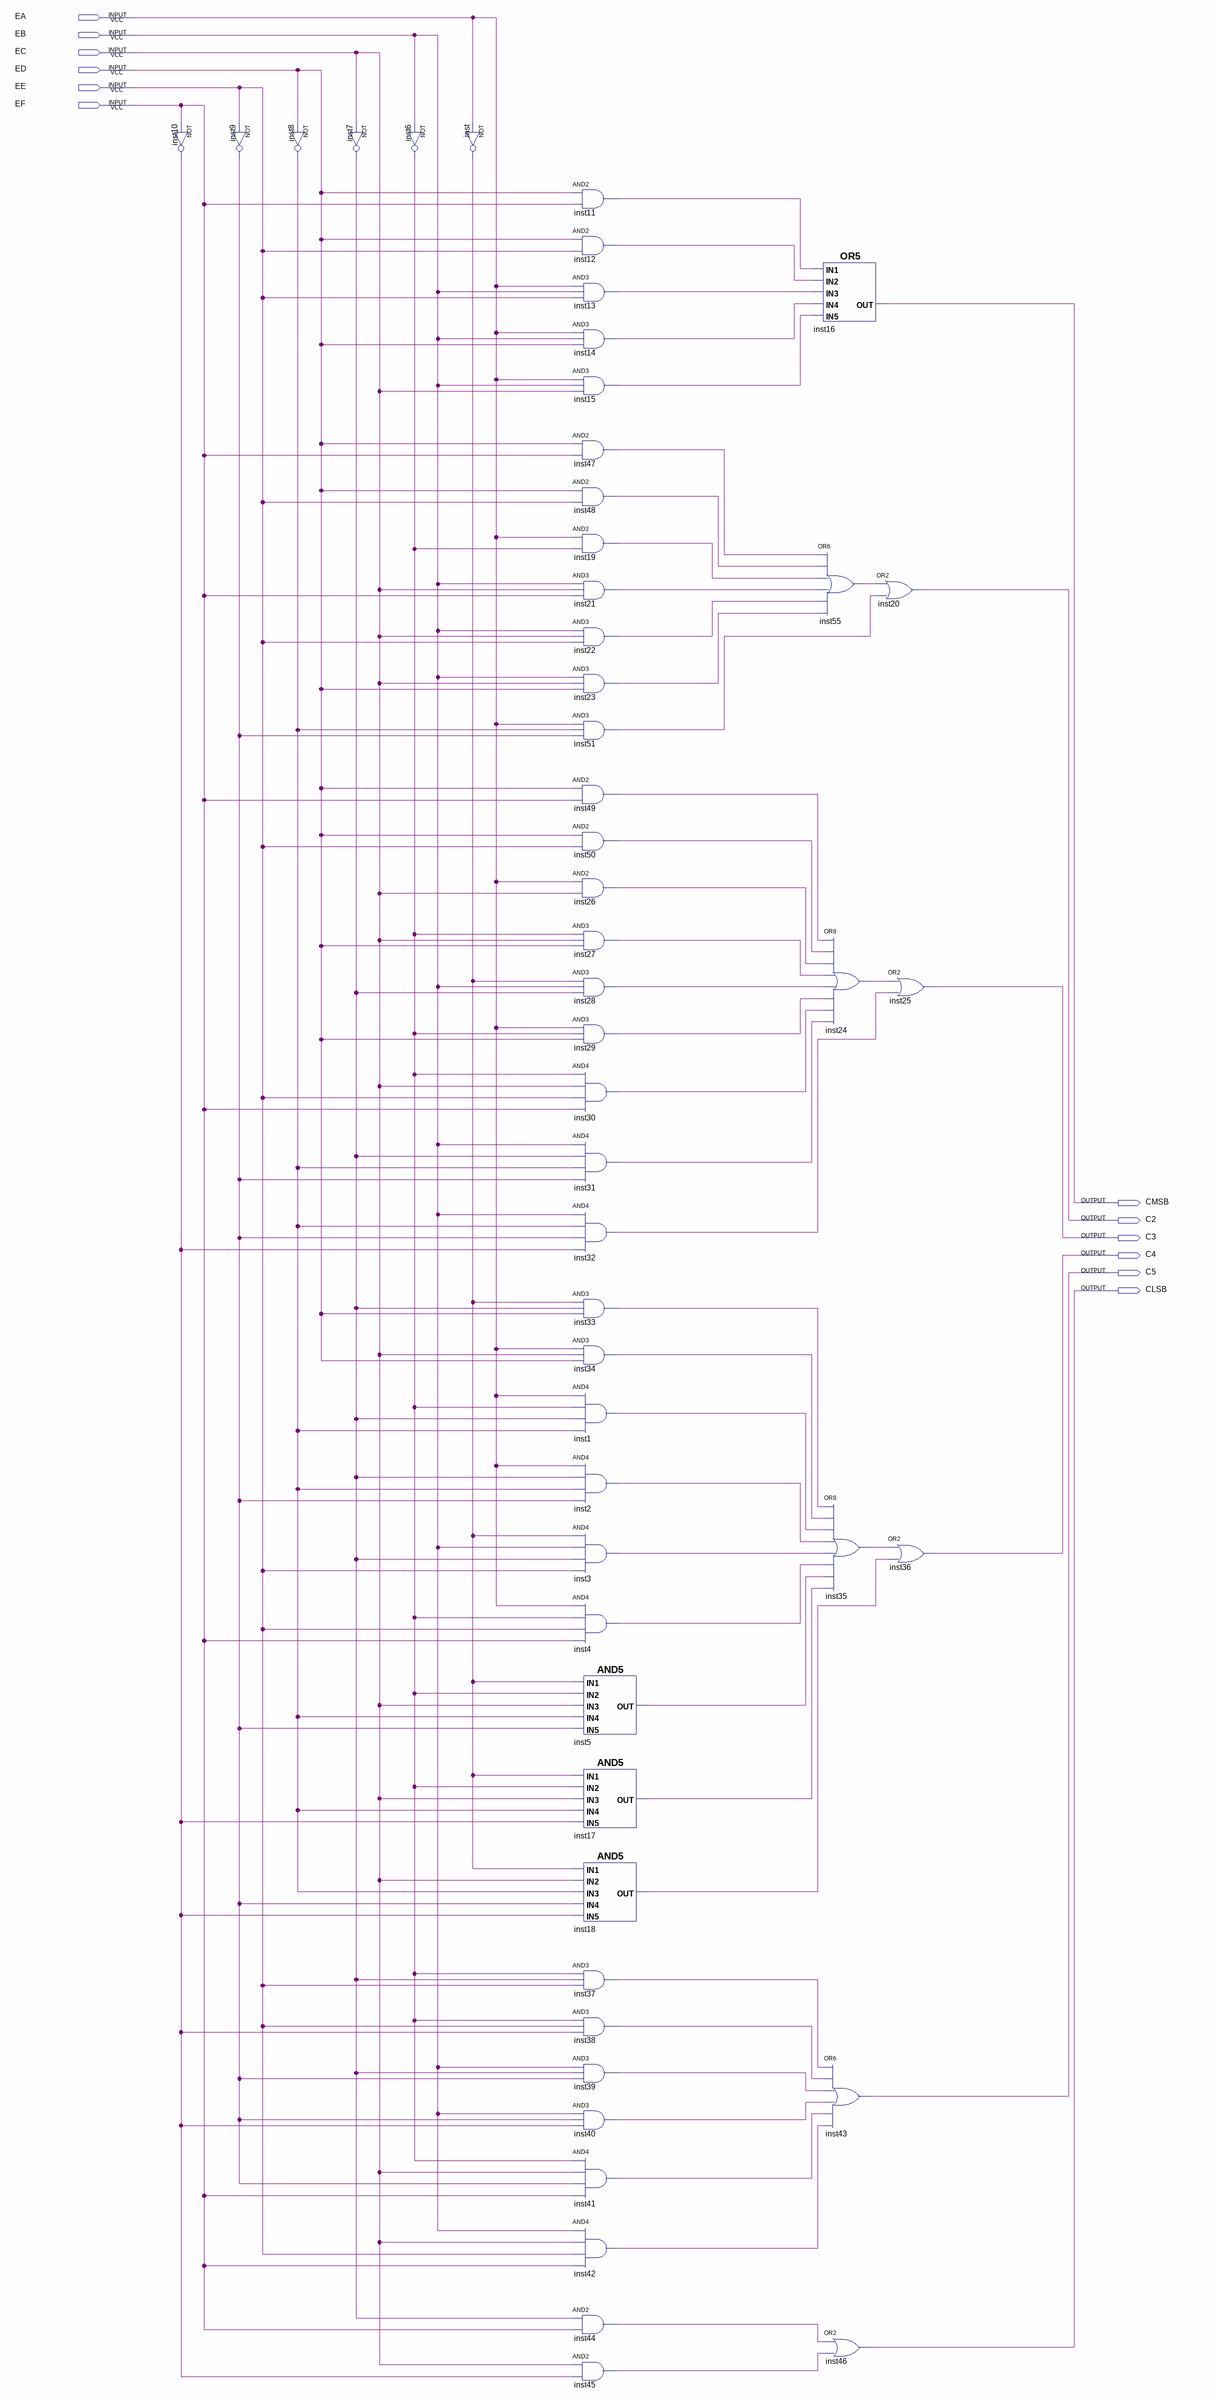
[diagram p0: schematic sheet]
// Quartus schematic Codificador.bdf as structural Verilog: 53 symbols, 12 pins
module Codificador (
  input  EA,
  input  EB,
  input  EC,
  input  ED,
  input  EE,
  input  EF,
  output CMSB,
  output C2,
  output C3,
  output C4,
  output C5,
  output CLSB
);

  wire inst1_out, inst2_out, inst3_out, inst4_out, inst5_out, inst6_out, inst7_out, inst8_out, inst9_out,
       inst10_out, inst11_out, inst12_out, inst13_out, inst14_out, inst15_out, inst17_out, inst18_out,
       inst19_out, inst21_out, inst22_out, inst23_out, inst24_out, inst26_out, inst27_out, inst28_out,
       inst29_out, inst30_out, inst31_out, inst32_out, inst33_out, inst34_out, inst35_out, inst37_out,
       inst38_out, inst39_out, inst40_out, inst41_out, inst42_out, inst44_out, inst45_out, inst47_out,
       inst48_out, inst49_out, inst50_out, inst51_out, inst55_out, inst_out;

  not inst10 (inst10_out, EF);
  not inst9 (inst9_out, EE);
  not inst8 (inst8_out, ED);
  not inst7 (inst7_out, EC);
  not inst6 (inst6_out, EB);
  not inst (inst_out, EA);
  and inst11 (inst11_out, ED, EF);
  and inst12 (inst12_out, ED, EE);
  and inst13 (inst13_out, EA, EB, EE);
  and inst14 (inst14_out, EA, EB, ED);
  and inst15 (inst15_out, EA, EB, EC);
  and inst47 (inst47_out, ED, EF);
  and inst48 (inst48_out, ED, EE);
  and inst19 (inst19_out, EA, inst6_out);
  and inst21 (inst21_out, EB, EC, EF);
  and inst22 (inst22_out, EB, EC, EE);
  and inst23 (inst23_out, EB, EC, ED);
  and inst51 (inst51_out, EA, inst8_out, inst9_out);
  and inst49 (inst49_out, ED, EF);
  and inst50 (inst50_out, ED, EE);
  and inst26 (inst26_out, EA, EC);
  and inst27 (inst27_out, inst6_out, EC, ED);
  and inst28 (inst28_out, inst_out, EB, inst7_out);
  and inst29 (inst29_out, EA, inst6_out, ED);
  and inst30 (inst30_out, inst6_out, EC, EE, EF);
  and inst31 (inst31_out, EB, inst7_out, inst8_out, inst9_out);
  and inst32 (inst32_out, EB, inst8_out, inst9_out, inst10_out);
  and inst33 (inst33_out, inst_out, inst7_out, ED);
  and inst34 (inst34_out, EA, EC, ED);
  and inst1 (inst1_out, EA, inst6_out, inst7_out, inst8_out);
  and inst2 (inst2_out, EA, inst7_out, inst8_out, inst9_out);
  and inst3 (inst3_out, inst_out, EB, inst7_out, EE);
  and inst4 (inst4_out, EA, inst6_out, EE, EF);
  and inst5 (inst5_out, inst_out, inst6_out, EC, inst8_out, inst9_out);
  and inst17 (inst17_out, inst_out, inst6_out, EC, inst8_out, inst10_out);
  and inst18 (inst18_out, inst_out, EC, inst8_out, inst9_out, inst10_out);
  and inst37 (inst37_out, inst6_out, inst7_out, EE);
  and inst38 (inst38_out, inst6_out, EE, inst10_out);
  and inst39 (inst39_out, EB, inst7_out, inst9_out);
  and inst40 (inst40_out, EB, inst9_out, inst10_out);
  and inst41 (inst41_out, inst6_out, EC, inst9_out, EF);
  and inst42 (inst42_out, EB, EC, EE, EF);
  and inst44 (inst44_out, inst7_out, EF);
  and inst45 (inst45_out, EC, inst10_out);
  or inst16 (CMSB, inst11_out, inst12_out, inst13_out, inst14_out, inst15_out);
  or inst55 (inst55_out, inst47_out, inst48_out, inst19_out, inst21_out, inst22_out, inst23_out);
  or inst24 (inst24_out, inst49_out, inst50_out, inst26_out, inst27_out, inst28_out, inst29_out, inst30_out, inst31_out);
  or inst35 (inst35_out, inst33_out, inst34_out, inst1_out, inst2_out, inst3_out, inst4_out, inst5_out, inst17_out);
  or inst43 (C5, inst37_out, inst38_out, inst39_out, inst40_out, inst41_out, inst42_out);
  or inst46 (CLSB, inst44_out, inst45_out);
  or inst20 (C2, inst55_out, inst51_out);
  or inst25 (C3, inst24_out, inst32_out);
  or inst36 (C4, inst35_out, inst18_out);
endmodule
